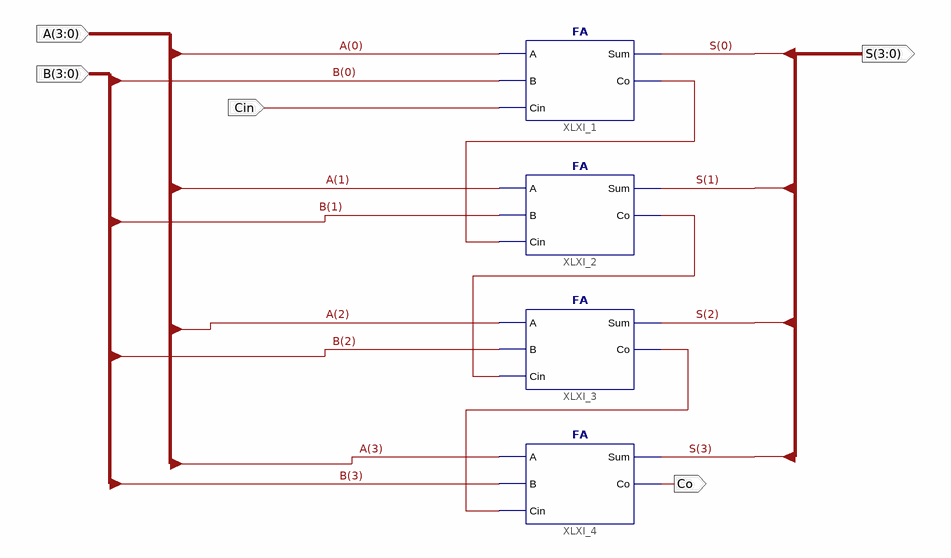
[diagram p0: schematic sheet 1]
// Xilinx ISE schematic four_bit_adder.sch (artix7) as structural Verilog: 4 symbols, 5 ports
module four_bit_adder (
  input  [3:0] A,
  input  [3:0] B,
  input  Cin,
  output [3:0] S,
  output Co
);

  wire XLXN_1, XLXN_2, XLXN_3;

  FA XLXI_1 (.A(A[0]), .B(B[0]), .Cin(Cin), .Co(XLXN_1), .Sum(S[0]));
  FA XLXI_2 (.A(A[1]), .B(B[1]), .Cin(XLXN_1), .Co(XLXN_2), .Sum(S[1]));
  FA XLXI_3 (.A(A[2]), .B(B[2]), .Cin(XLXN_2), .Co(XLXN_3), .Sum(S[2]));
  FA XLXI_4 (.A(A[3]), .B(B[3]), .Cin(XLXN_3), .Co(Co), .Sum(S[3]));
endmodule
